# Altium schematic sheet 05 COMMUNICATION.SchDoc: COMMUNICATION
size 420 x 297 mm; SheetNumber: 5; SheetTotal: 6
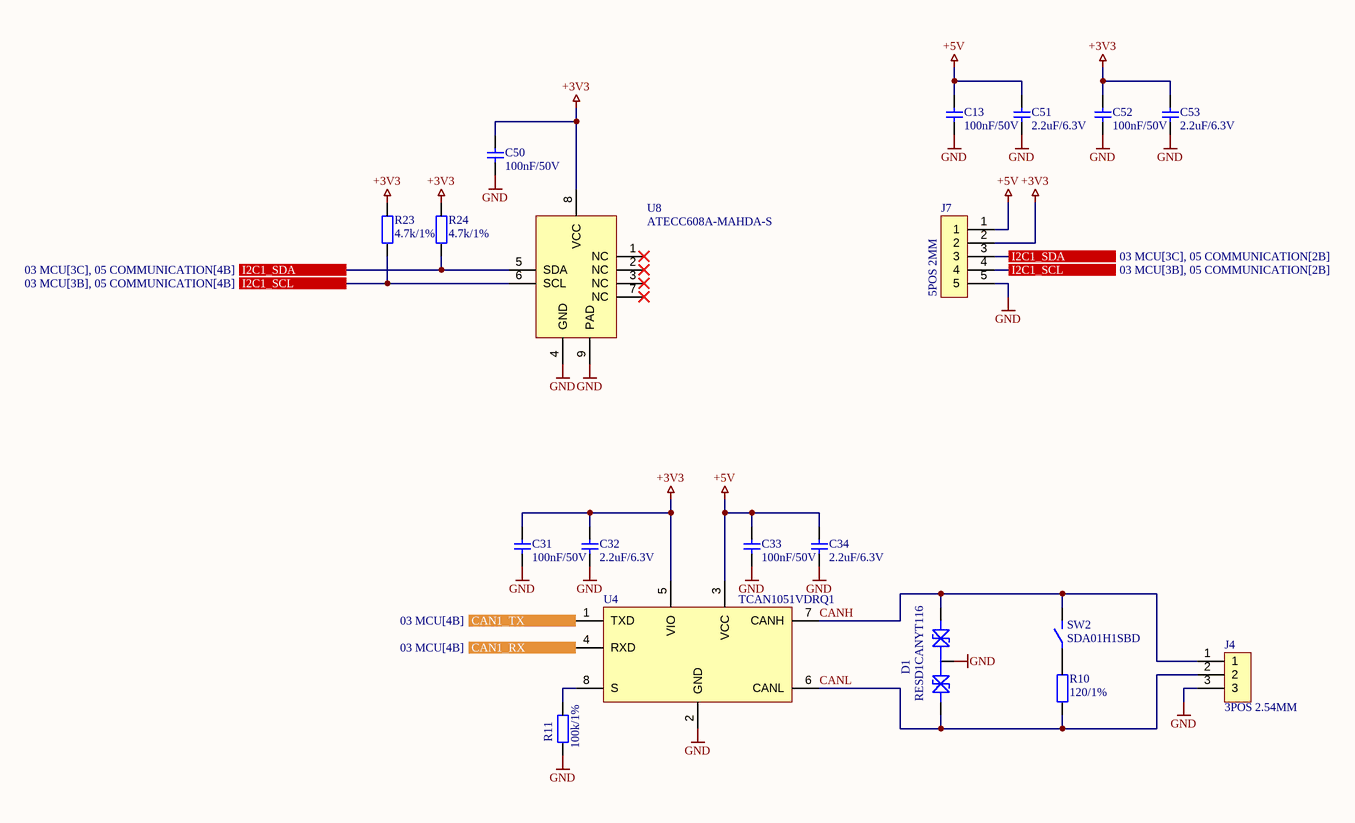
[diagram p0: 05 COMMUNICATION.SchDoc]

## Parts
C13  100nF/50V  [CAPC1005X06M-0402]
C31  100nF/50V  [CAPC1005X06M-0402]
C32  2.2uF/6.3V  [CAPC1005X06M-0402]
C33  100nF/50V  [CAPC1005X06M-0402]
C34  2.2uF/6.3V  [CAPC1005X06M-0402]
C50  100nF/50V  [CAPC1005X06M-0402]
C51  2.2uF/6.3V  [CAPC1005X06M-0402]
C52  100nF/50V  [CAPC1005X06M-0402]
C53  2.2uF/6.3V  [CAPC1005X06M-0402]
D1  RESD1CANYT116  [SOT100P240X115-3N]
J4  3POS 2.54MM  [282834-3]
J7  5POS 2MM  [B5B-PH-K-S]
R10  120/1%  [RESC1005X04M-0402]
R11  100k/1%  [RESC1005X04M-0402]
R23  4.7k/1%  [RESC1005X04M-0402]
R24  4.7k/1%  [RESC1005X04M-0402]
SW2  SDA01H1SBD  [SDA01H1SB]
U4  TCAN1051VDRQ1  [SOIC127P600X175-8N]
U8  ATECC608A-MAHDA-S  [SON50P200X60_HS-9N]

## Ports
CAN1_RX (see 03 MCU[4B]), CAN1_TX (see 03 MCU[4B]), I2C1_SCL (see 03 MCU[3B], 05 COMMUNICATION[2B]), I2C1_SCL (see 03 MCU[3B], 05 COMMUNICATION[4B]), I2C1_SDA (see 03 MCU[3C], 05 COMMUNICATION[2B]), I2C1_SDA (see 03 MCU[3C], 05 COMMUNICATION[4B])

## Nets
+3V3: C31.2 C32.2 C50.2 C52.2 C53.2 J7.2 R23.2 R24.2 U4.5(VIO) U8.8(VCC)
+5V: C13.2 C33.2 C34.2 C51.2 J7.1 U4.3(VCC)
GND: C13.1 C31.1 C32.1 C33.1 C34.1 C50.1 C51.1 C52.1 C53.1 D1.3 J4.3 J7.5 R11.1 U4.2(GND) U8.4(GND) U8.9(PAD)
CAN1_RX: U4.4(RXD) ; port CAN1_RX
CAN1_TX: U4.1(TXD) ; port CAN1_TX
CANH: D1.1 J4.1 SW2.2 U4.7(CANH)
CANL: D1.2 J4.2 R10.1 U4.6(CANL)
I2C1_SCL: J7.4 R23.1 U8.6(SCL) ; port I2C1_SCL
I2C1_SDA: J7.3 R24.1 U8.5(SDA) ; port I2C1_SDA
NetR10_2: R10.2 SW2.1
NetR11_2: R11.2 U4.8(S)

Not connected (* = marked no-connect by the designer): U8 1(NC)* 2(NC)* 3(NC)* 7(NC)*

## Notes on the sheet
- Title
- Project
- Size
- Date
- Revision
- A3
- Designed By

## Library data of the parts
C13 C31 C33 C50 C52 = GRM155R71H104KE14D: 0.1 µF ±10% 50V Ceramic Capacitor X7R 0402 (1005 Metric); ComponentLink1Description: Datasheet; ComponentLink1URL: https://search.murata.co.jp/Ceramy/image/img/A01X/G101/ENG/GRM155R60J475ME47-01.pdf; MPN: GRM155R71H104KE14D
C32 C34 C51 C53 = GRM155C80J225KE95D: 2.2 µF ±10% 6.3V Ceramic Capacitor X6S 0402 (1005 Metric); ComponentLink1Description: Datasheet; ComponentLink1URL: https://search.murata.co.jp/Ceramy/image/img/A01X/G101/ENG/GRM155R60J475ME47-01.pdf; MPN: GRM155C80J225KE95D
D1 = RESD1CANYT116: 44V Clamp 8A (8/20µs) Ipp Tvs Diode Surface Mount SOT-23; ComponentLink1Description: Datasheet; ComponentLink1URL: https://fscdn.rohm.com/en/products/databook/datasheet/discrete/diode/zener/resd1canyt116-e.pdf; MPN: RESD1CANYT116
J4 = 282834-3: 3 Position Wire to Board Terminal Block Horizontal with Board 0.100" (2.54mm) Through Hole; ComponentLink1Description: Datasheet; ComponentLink1URL: https://www.te.com/commerce/DocumentDelivery/DDEController?Action=srchrtrv&DocNm=282834&DocType=Customer+Drawing&DocLang=English; MPN: 282834-3
J7 = B5B-PH-K-S: Connector Header Through Hole 5 position 0.079" (2.00mm); ComponentLink1Description: Datasheet; ComponentLink1URL: https://www.jst-mfg.com/product/pdf/eng/ePH.pdf; MPN: B5B-PH-K-S
R10 = RC0402FR-07120RL: 120 Ohms ±1% 0.063W, 1/16W Chip Resistor 0402 (1005 Metric) Moisture Resistant Thick Film; ComponentLink1Description: Datasheet; ComponentLink1URL: https://www.yageo.com/upload/media/product/productsearch/datasheet/rchip/PYu-RC_Group_51_RoHS_L_12.pdf; MPN: RC0402FR-07120RL
R11 = RC0402FR-07100KL: 100 kOhms ±1% 0.063W, 1/16W Chip Resistor 0402 (1005 Metric) Moisture Resistant Thick Film; ComponentLink1Description: Datasheet; ComponentLink1URL: https://www.yageo.com/upload/media/product/productsearch/datasheet/rchip/PYu-RC_Group_51_RoHS_L_12.pdf; MPN: RC0402FR-07100KL
R23 R24 = RC0402FR-074K7L: 4.7 kOhms ±1% 0.063W, 1/16W Chip Resistor 0402 (1005 Metric) Moisture Resistant Thick Film; ComponentLink1Description: Datasheet; ComponentLink1URL: https://www.yageo.com/upload/media/product/productsearch/datasheet/rchip/PYu-RC_Group_51_RoHS_L_12.pdf; MPN: RC0402FR-074K7L
SW2 = SDA01H1SBD: Dip Switch SPST 1 Position Surface Mount Slide (Standard) Actuator 25mA 24VDC; ComponentLink1Description: Datasheet; ComponentLink1URL: https://www.ckswitches.com/media/1327/sda.pdf; MPN: SDA01H1SBD
U4 = TCAN1051VDRQ1: 1/1 Transceiver Half CANbus 8-SOIC; ComponentLink1Description: Datasheet; ComponentLink1URL: https://www.ti.com/general/docs/suppproductinfo.tsp?distId=10&gotoUrl=https%3A%2F%2Fwww.ti.com%2Flit%2Fgpn%2Ftcan1051-q1; MPN: TCAN1051VDRQ1
U8 = ATECC608A-MAHDA-S: Authentication Chip 8-UDFN (2x3); MPN: ATECC608A-MAHDA-S; ComponentLink1Description: Datasheet; ComponentLink1URL: https://ww1.microchip.com/downloads/en/DeviceDoc/ATECC608A-CryptoAuthentication-Device-Summary-Data-Sheet-DS40001977B.pdf